# Altium project CV25_Camera_DATN.PrjPcb
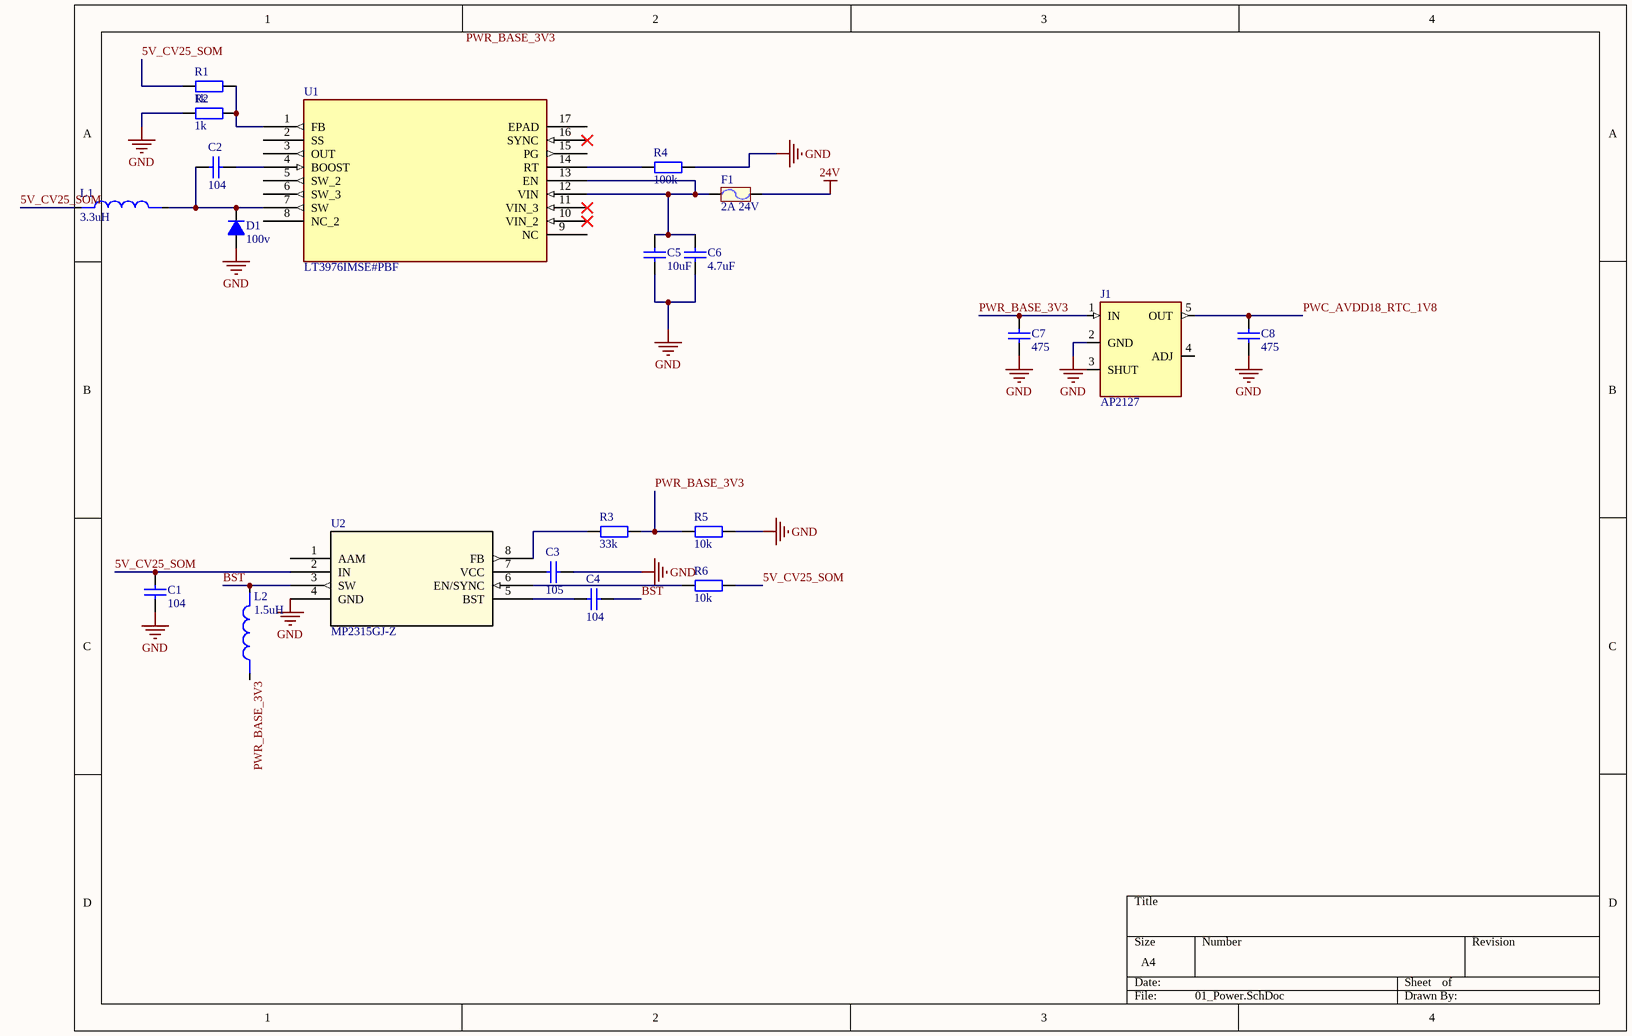
[diagram p0: 01_Power.SchDoc]
4 sheets, 69 parts. Net scope: global (net labels, ports and power ports of the same name join across sheets).
Board file: PCB1.PcbDoc
Sheets:
  01_Power.SchDoc
  02_CV25_SOM.SchDoc
  03_Ethernet.SchDoc
  05_LensControl.SchDoc

## Sheet 01_Power.SchDoc
size A4; SheetNumber: 1; SheetTotal: 5

### Parts
C1  104  [tu 0603]
C2  104  [tu 0603]
C3  105  [tu 0603]
C4  104  [tu 0603]
C5  10uF  [tu 0603]
C6  4.7uF  [tu 0603]
C7  475  [tu 0805]
C8  475  [tu 0805]
D1  100v  [DIODE 1A]
F1  2A 24V  [Cau chi tu phuc hoi 2A 24V SMD1812]
J1  AP2127  [AP2127K-3.3]
L1  3.3uH  [CUON CAM SMD 0530]
L2  1.5uH  [CUON CAM SMD 0530]
R1  1k  [tro smd 0603]
R2  1k  [tro smd 0603]
R3  33k  [Tro smd 0603]
R4  100k  [tro smd 0805]
R5  10k  [tro smd 0603]
R6  10k  [tro smd 0603]
U1  LT3976IMSE#PBF  [MSOP-16_MSE]
U2  MP2315GJ-Z  [TSOT23-8_MPS]

### Nets
24V: F1.2
GND: C1.2 C3.1 C5.1 C6.1 C7.2 C8.2 D1.1(A) J1.2(GND) R2.1 R4.2 R5.2 U2.4(GND)
5V_CV25_SOM: C1.1 L1.1 R1.1 R6.2 U2.2(IN)
BST: C4.1 L2.2 U2.3(SW)
PWC_AVDD18_RTC_1V8: C8.1 J1.5(OUT)
PWR_BASE_3V3: C7.1 J1.1(IN) L2.1 R3.2 R5.1
NetC2_1: C2.1 U1.4(BOOST)
NetC2_2: C2.2 D1.2(K) L1.2 U1.7(SW)
NetC3_2: C3.2 U2.7(VCC)
NetC4_2: C4.2 U2.5(BST)
NetC5_2: C5.2 C6.2 F1.1 U1.12(VIN) U1.13(EN)
NetR1_2: R1.2 R2.2 U1.1(FB)
NetR3_1: R3.1 U2.8(FB)
NetR4_1: R4.1 U1.14(RT)
NetR6_1: R6.1 U2.6(EN/SYNC)

Not connected (* = marked no-connect by the designer): J1 3(SHUT) 4(ADJ); U1 2(SS) 3(OUT) 5(SW_2) 6(SW_3) 8(NC_2) 9(NC) 10(VIN_2)* 11(VIN_3)* 15(PG) 16(SYNC)* 17(EPAD); U2 1(AAM)

### Notes on the sheet
- Labels drawn without touching a wire or pin: PWR_BASE_3V3

### Library data of the parts
C1 C2 C4 = Tu 0603 104 50V 10%: Dán; Don_Vi: Con; So_Chan: 2; Ten_Linh_Kien: Tụ 0603 104-100nF 10% 50V; Ma_Hang: MH004568; Chung_Loai: Dán; Kieu_Chan: *
C3 = Tu 0603 105 16V 20%: Dán; Don_Vi: Con; So_Chan: 2; Ten_Linh_Kien: Tụ 0603 105-1uF 20% 16V; Ma_Hang: MH004574; Chung_Loai: Dán; Kieu_Chan: *
C5 C6 = Tu 0603 470pF 50V 10%: Dán; Don_Vi: Con; So_Chan: 2; Ten_Linh_Kien: Tụ 0603 470P 50V 10%; Ma_Hang: MH004571; Chung_Loai: Dán; Kieu_Chan: *
C7 C8 = Tu 0805 475 25V 20%: Dán; Don_Vi: Con; So_Chan: 2; Ten_Linh_Kien: Tụ 0805 475-4.7uF 20% 25V; Ma_Hang: MH004276; Chung_Loai: Dán; Kieu_Chan: *
D1 = Diode 1N4007: Cắm; Ten_Linh_Kien: Diode 1N4007 1A (DIP); Don_Vi: Con; Ma_Hang: MH001063; Ghi Chu: *; Kieu_Chan: *; Chung_Loai: Cắm
F1 = Cau chi tu phuc hoi 2A 24V SMD1812: 2A 24V SMD1812; Ma_Hang: MH010033; Ten: Cầu Chì Tự Phục Hồi 2A 24V SMD1812
J1 = AP2127: LDO Regulator Pos 1.8V 0.4A 5-Pin SOT-23 T/R / IC REG LDO 1.8V 0.3A SOT23-5; MF: Diodes Incorporated; SnapEDA_Link: https://www.snapeda.com/parts/AP2127/EDTM+Incorporated/view-part/?ref=snap; Package: None; Value: *; MP: AP2127; Check_prices: https://www.snapeda.com/parts/AP2127/EDTM+Incorporated/view-part/?ref=eda
L1 L2 = Cuon Cam SMD 0530: SMD 0530; MP: FDV0530-H-1R5M=P3; Package: None; Price: None; Value: *; Availability: Unavailable
R1 R2 = Tro 0603 1% 1k: Dán; So_Chan: 2; Don_Vi: Con; Ten_Linh_Kien: Trở 0603 1% 1k; Ma_Hang: MH006334; Chung_Loai: Dán; Kieu_Chan: *
R3 = Tro 0603 1% 33k: Dán; Don_Vi: Con; So_Chan: 2; Ten_Linh_Kien: Trở 0603 1% 33k; Ma_Hang: MH006335; Chung_Loai: Dán; Kieu_Chan: *
R4 = Tro 0805 5% 100k: Dán; Don_Vi: Con; So_Chan: 2; Ten_Linh_Kien: Trở 0805 5% 100k; Ma_Hang: MH005250; Chung_Loai: Dán; Kieu_Chan: *
R5 R6 = Tro 0603 1% 10k: Dán; Don_Vi: Con; So_Chan: 2; Ten_Linh_Kien: Trở 0603 1% 10k; Ma_Hang: MH006333; Chung_Loai: Dán; Kieu_Chan: *
U1 = LT3976IMSE#PBF: 40V, 5A, 2MHz Step-Down Switching Regulator with 3.3Î¼A Quiescent Current; MF: Analog Devices; Value: *; Price: None; Package: MSOP -16 Analog Devices; MP: LT3976IMSE#PBF; Purchase-URL: https://pricing.snapeda.com/search/part/LT3976IMSE#PBF/?ref=eda; SnapEDA_Link: https://www.snapeda.com/parts/LT3976IMSE%23PBF/Analog+Devices/view-part/?ref=snap; Check_prices: https://www.snapeda.com/parts/LT3976IMSE%23PBF/Analog+Devices/view-part/?ref=eda; Availability: In Stock
U2 = MP2315GJ-Z: High Efficiency 3A 24V 500kHz with AAM (light load mode) Synchronous Step Down Converter in TSOT23-8; Manufacturer_Name: Monolithic Power Systems; Copyright: Copyright (C) 2026 Ultra Librarian. All rights reserved.; Manufacturer_Part_Number: MP2315GJ-Z; RefDes: RefDes; Type: Type

## Sheet 02_CV25_SOM.SchDoc
size A4; SheetNumber: 2; SheetTotal: 5
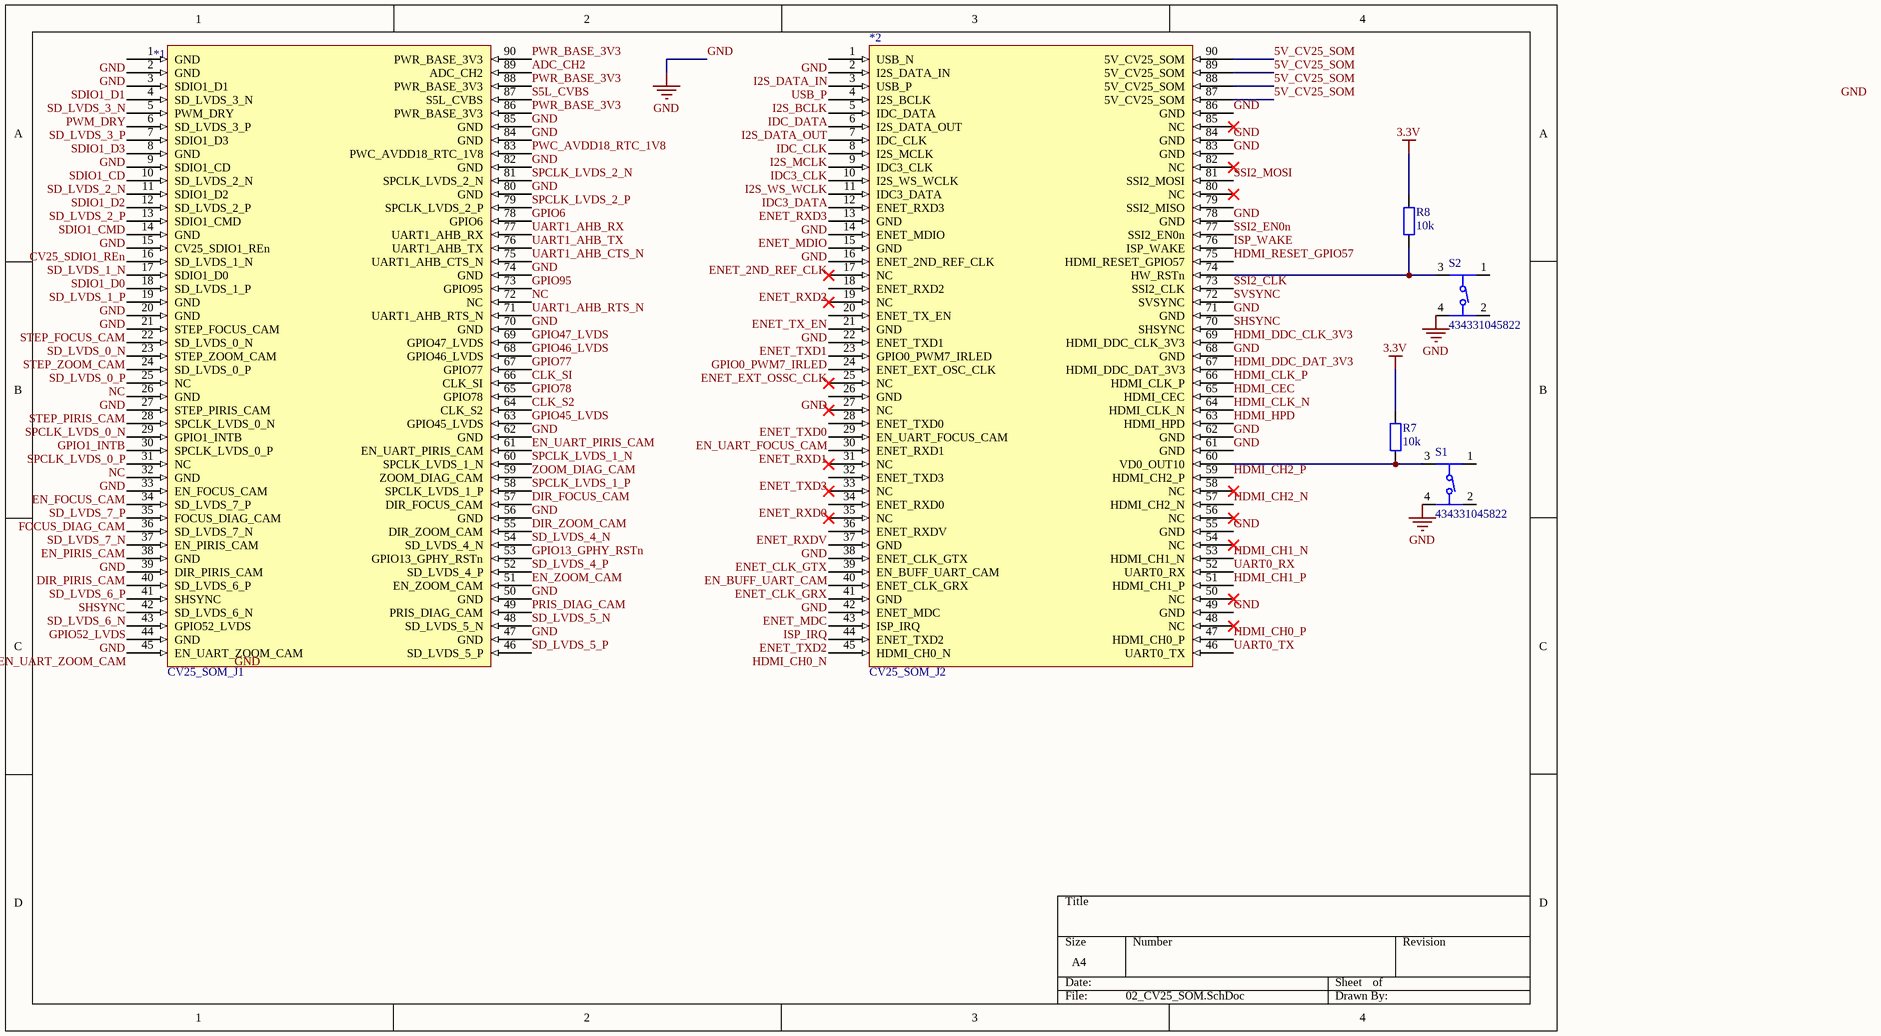
[diagram p1: 02_CV25_SOM.SchDoc]

### Parts
*1  CV25_SOM_J1  [HIROSE_DF40C-90DS-0.4V(51)]
*2  CV25_SOM_J2  [HIROSE_DF40C-90DS-0.4V(51)]
R7  10k  [tro smd 0603]
R8  10k  [tro smd 0603]
S1  434331045822  [4343X10458XX]
S2  434331045822  [4343X10458XX]

### Nets
3.3V: R7.2 R8.2
GND: *1.1(GND) *1.2(GND) *1.8(GND) *1.14(GND) *1.19(GND) *1.20(GND) *1.26(GND) *1.32(GND) *1.38(GND) *1.44(GND) *1.47(GND) *1.50(GND) *1.56(GND) *1.62(GND) *1.70(GND) *1.74(GND) *1.80(GND) *1.82(GND) *1.84(GND) *1.85(GND) *2.1(USB_N) *2.13(GND) *2.15(GND) *2.21(GND) *2.26(GND) *2.37(GND) *2.41(GND) *2.49(GND) *2.55(GND) *2.61(GND) *2.62(GND) *2.68(GND) *2.71(GND) *2.78(GND) *2.83(GND) *2.84(GND) *2.86(GND) S1.4 S2.4
5V_CV25_SOM: *2.87(5V_CV25_SOM) *2.88(5V_CV25_SOM) *2.89(5V_CV25_SOM) *2.90(5V_CV25_SOM)
ADC_CH2: *1.89(ADC_CH2)
CLK_S2: *1.64(CLK_S2)
CLK_SI: *1.66(CLK_SI)
CV25_SDIO1_REn: *1.15(CV25_SDIO1_REn)
DIR_FOCUS_CAM: *1.57(DIR_FOCUS_CAM)
DIR_PIRIS_CAM: *1.39(DIR_PIRIS_CAM)
DIR_ZOOM_CAM: *1.55(DIR_ZOOM_CAM)
EN_BUFF_UART_CAM: *2.39(EN_BUFF_UART_CAM)
EN_FOCUS_CAM: *1.33(EN_FOCUS_CAM)
EN_PIRIS_CAM: *1.37(EN_PIRIS_CAM)
EN_UART_FOCUS_CAM: *2.29(EN_UART_FOCUS_CAM)
EN_UART_PIRIS_CAM: *1.61(EN_UART_PIRIS_CAM)
EN_UART_ZOOM_CAM: *1.45(EN_UART_ZOOM_CAM)
EN_ZOOM_CAM: *1.51(EN_ZOOM_CAM)
ENET_2ND_REF_CLK: *2.16(ENET_2ND_REF_CLK)
ENET_CLK_GRX: *2.40(ENET_CLK_GRX)
ENET_CLK_GTX: *2.38(ENET_CLK_GTX)
ENET_EXT_OSSC_CLK: *2.24(ENET_EXT_OSC_CLK)
ENET_MDC: *2.42(ENET_MDC)
ENET_MDIO: *2.14(ENET_MDIO)
ENET_RXD0: *2.34(ENET_RXD0)
ENET_RXD1: *2.30(ENET_RXD1)
ENET_RXD2: *2.18(ENET_RXD2)
ENET_RXD3: *2.12(ENET_RXD3)
ENET_RXDV: *2.36(ENET_RXDV)
ENET_TX_EN: *2.20(ENET_TX_EN)
ENET_TXD0: *2.28(ENET_TXD0)
ENET_TXD1: *2.22(ENET_TXD1)
ENET_TXD2: *2.44(ENET_TXD2)
ENET_TXD3: *2.32(ENET_TXD3)
FOCUS_DIAG_CAM: *1.35(FOCUS_DIAG_CAM)
GPIO0_PWM7_IRLED: *2.23(GPIO0_PWM7_IRLED)
GPIO1_INTB: *1.29(GPIO1_INTB)
GPIO6: *1.78(GPIO6)
GPIO13_GPHY_RSTn: *1.53(GPIO13_GPHY_RSTn)
GPIO45_LVDS: *1.63(GPIO45_LVDS)
GPIO46_LVDS: *1.68(GPIO46_LVDS)
GPIO47_LVDS: *1.69(GPIO47_LVDS)
GPIO52_LVDS: *1.43(GPIO52_LVDS)
GPIO77: *1.67(GPIO77)
GPIO78: *1.65(GPIO78)
GPIO95: *1.73(GPIO95)
HDMI_CEC: *2.65(HDMI_CEC)
HDMI_CH0_N: *2.45(HDMI_CH0_N)
HDMI_CH0_P: *2.47(HDMI_CH0_P)
HDMI_CH1_N: *2.53(HDMI_CH1_N)
HDMI_CH1_P: *2.51(HDMI_CH1_P)
HDMI_CH2_N: *2.57(HDMI_CH2_N)
HDMI_CH2_P: *2.59(HDMI_CH2_P)
HDMI_CLK_N: *2.64(HDMI_CLK_N)
HDMI_CLK_P: *2.66(HDMI_CLK_P)
HDMI_DDC_CLK_3V3: *2.69(HDMI_DDC_CLK_3V3)
HDMI_DDC_DAT_3V3: *2.67(HDMI_DDC_DAT_3V3)
HDMI_HPD: *2.63(HDMI_HPD)
HDMI_RESET_GPIO57: *2.75(HDMI_RESET_GPIO57)
I2S_BCLK: *2.4(I2S_BCLK)
I2S_DATA_IN: *2.2(I2S_DATA_IN)
I2S_DATA_OUT: *2.6(I2S_DATA_OUT)
I2S_MCLK: *2.8(I2S_MCLK)
I2S_WS_WCLK: *2.10(I2S_WS_WCLK)
IDC3_CLK: *2.9(IDC3_CLK)
IDC3_DATA: *2.11(IDC3_DATA)
IDC_CLK: *2.7(IDC_CLK)
IDC_DATA: *2.5(IDC_DATA)
ISP_IRQ: *2.43(ISP_IRQ)
ISP_WAKE: *2.76(ISP_WAKE)
NC: *1.25(NC) *1.31(NC) *1.72(NC)
PRIS_DIAG_CAM: *1.49(PRIS_DIAG_CAM)
PWC_AVDD18_RTC_1V8: *1.83(PWC_AVDD18_RTC_1V8)
PWM_DRY: *1.5(PWM_DRY)
PWR_BASE_3V3: *1.86(PWR_BASE_3V3) *1.88(PWR_BASE_3V3) *1.90(PWR_BASE_3V3)
S5L_CVBS: *1.87(S5L_CVBS)
SD_LVDS_0_N: *1.22(SD_LVDS_0_N)
SD_LVDS_0_P: *1.24(SD_LVDS_0_P)
SD_LVDS_1_N: *1.16(SD_LVDS_1_N)
SD_LVDS_1_P: *1.18(SD_LVDS_1_P)
SD_LVDS_2_N: *1.10(SD_LVDS_2_N)
SD_LVDS_2_P: *1.12(SD_LVDS_2_P)
SD_LVDS_3_N: *1.4(SD_LVDS_3_N)
SD_LVDS_3_P: *1.6(SD_LVDS_3_P)
SD_LVDS_4_N: *1.54(SD_LVDS_4_N)
SD_LVDS_4_P: *1.52(SD_LVDS_4_P)
SD_LVDS_5_N: *1.48(SD_LVDS_5_N)
SD_LVDS_5_P: *1.46(SD_LVDS_5_P)
SD_LVDS_6_N: *1.42(SD_LVDS_6_N)
SD_LVDS_6_P: *1.40(SD_LVDS_6_P)
SD_LVDS_7_N: *1.36(SD_LVDS_7_N)
SD_LVDS_7_P: *1.34(SD_LVDS_7_P)
SDIO1_CD: *1.9(SDIO1_CD)
SDIO1_CMD: *1.13(SDIO1_CMD)
SDIO1_D0: *1.17(SDIO1_D0)
SDIO1_D1: *1.3(SDIO1_D1)
SDIO1_D2: *1.11(SDIO1_D2)
SDIO1_D3: *1.7(SDIO1_D3)
SHSYNC: *1.41(SHSYNC) *2.70(SHSYNC)
SPCLK_LVDS_0_N: *1.28(SPCLK_LVDS_0_N)
SPCLK_LVDS_0_P: *1.30(SPCLK_LVDS_0_P)
SPCLK_LVDS_1_N: *1.60(SPCLK_LVDS_1_N)
SPCLK_LVDS_1_P: *1.58(SPCLK_LVDS_1_P)
SPCLK_LVDS_2_N: *1.81(SPCLK_LVDS_2_N)
SPCLK_LVDS_2_P: *1.79(SPCLK_LVDS_2_P)
SSI2_CLK: *2.73(SSI2_CLK)
SSI2_EN0n: *2.77(SSI2_EN0n)
SSI2_MOSI: *2.81(SSI2_MOSI)
STEP_FOCUS_CAM: *1.21(STEP_FOCUS_CAM)
STEP_PIRIS_CAM: *1.27(STEP_PIRIS_CAM)
STEP_ZOOM_CAM: *1.23(STEP_ZOOM_CAM)
SVSYNC: *2.72(SVSYNC)
UART0_RX: *2.52(UART0_RX)
UART0_TX: *2.46(UART0_TX)
UART1_AHB_CTS_N: *1.75(UART1_AHB_CTS_N)
UART1_AHB_RTS_N: *1.71(UART1_AHB_RTS_N)
UART1_AHB_RX: *1.77(UART1_AHB_RX)
UART1_AHB_TX: *1.76(UART1_AHB_TX)
USB_P: *2.3(USB_P)
ZOOM_DIAG_CAM: *1.59(ZOOM_DIAG_CAM)
Net*2_60: *2.60(VD0_OUT10) R7.1 S1.3
Net*2_74: *2.74(HW_RSTn) R8.1 S2.3

Not connected (* = marked no-connect by the designer): *2 17(NC)* 19(NC)* 25(NC)* 27(NC)* 31(NC)* 33(NC)* 35(NC)* 48(NC)* 50(NC)* 54(NC)* 56(NC)* 58(NC)* 79(SSI2_MISO) 80(NC)* 82(NC)* 85(NC)*; S1 1(3) 2(4); S2 1(3) 2(4)

### Notes on the sheet
- Labels drawn without touching a wire or pin: GND

### Library data of the parts
R7 R8 = Tro 0603 1% 10k: as R5 on sheet 01_Power; Chung_Loai: Dán; Kieu_Chan: *
S1 S2 = 434331045822: MF: {'manufacturer': u'W\xfcrth Elektronik'}; Package: None; Price: None; Value: *; MP: 434331045822; Availability: Unavailable

## Sheet 03_Ethernet.SchDoc
size A4; SheetNumber: 3; SheetTotal: 5
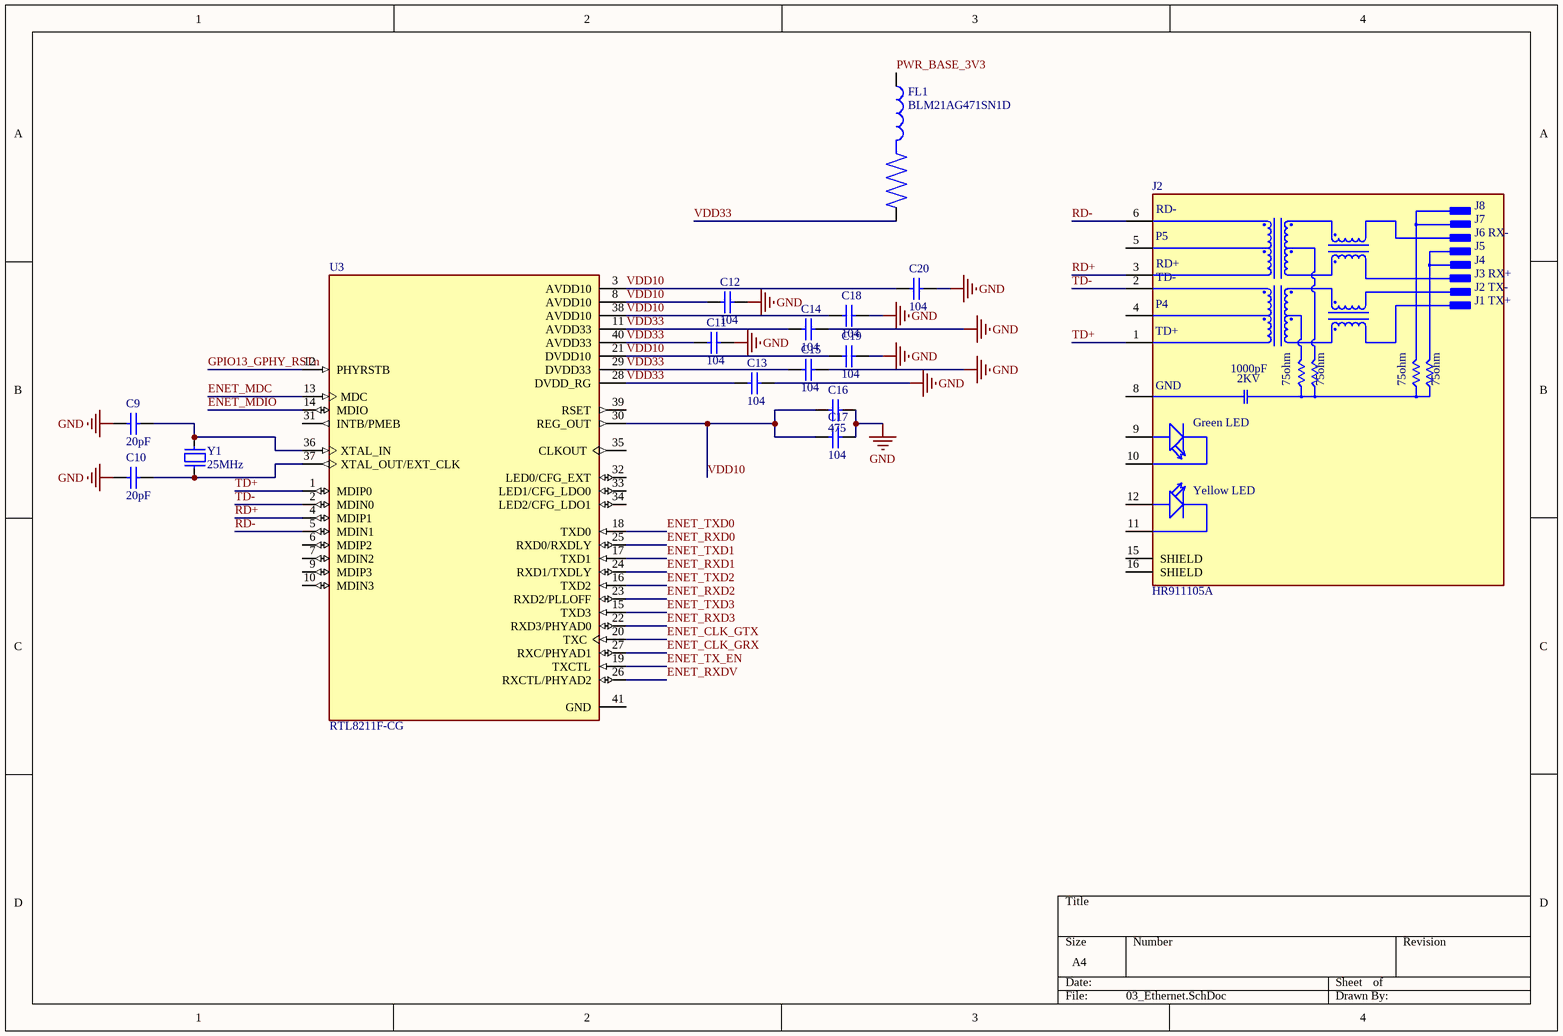
[diagram p2: 03_Ethernet.SchDoc]

### Parts
C9  20pF  [tu 0805]
C10  20pF  [tu 0805]
C11  104  [tu 1206]
C12  104  [tu 1206]
C13  104  [tu 1206]
C14  104  [tu 1206]
C15  104  [tu 1206]
C16  475  [tu 0805]
C17  104  [tu 1206]
C18  104  [tu 1206]
C19  104  [tu 1206]
C20  104  [tu 1206]
FL1  BLM21AG471SN1D  [BEADC2012X105N]
J2  HR911105A  [HANRUN_HR911105A]
U3  RTL8211F-CG  [QFN40P500X500X90-41N]
Y1  25MHz  [Thach Anh 2 Chan 32,768 KHz]

### Nets
GND: C9.1 C10.1 C11.1 C12.1 C13.1 C14.1 C15.1 C16.1 C17.1 C18.1 C19.1 C20.1
ENET_CLK_GRX: U3.27(RXC/PHYAD1)
ENET_CLK_GTX: U3.20(TXC)
ENET_MDC: U3.13(MDC)
ENET_MDIO: U3.14(MDIO)
ENET_RXD0: U3.25(RXD0/RXDLY)
ENET_RXD1: U3.24(RXD1/TXDLY)
ENET_RXD2: U3.23(RXD2/PLLOFF)
ENET_RXD3: U3.22(RXD3/PHYAD0)
ENET_RXDV: U3.26(RXCTL/PHYAD2)
ENET_TX_EN: U3.19(TXCTL)
ENET_TXD0: U3.18(TXD0)
ENET_TXD1: U3.17(TXD1)
ENET_TXD2: U3.16(TXD2)
ENET_TXD3: U3.15(TXD3)
GPIO13_GPHY_RSTn: U3.12(PHYRSTB)
PWR_BASE_3V3: FL1.1
RD+: J2.3(RD+) U3.4(MDIP1)
RD-: J2.6(RD-) U3.5(MDIN1)
TD+: J2.1(TD+) U3.1(MDIP0)
TD-: J2.2(TD-) U3.2(MDIN0)
VDD10: C12.2 C16.2 C17.2 C18.2 C19.2 C20.2 U3.3(AVDD10) U3.8(AVDD10) U3.21(DVDD10) U3.30(REG_OUT) U3.38(AVDD10)
VDD33: C11.2 C13.2 C14.2 C15.2 FL1.2 U3.11(AVDD33) U3.28(DVDD_RG) U3.29(DVDD33) U3.40(AVDD33)
NetC9_2: C9.2 U3.36(XTAL_IN) Y1.2
NetC10_2: C10.2 U3.37(XTAL_OUT/EXT_CLK) Y1.1

Not connected (* = marked no-connect by the designer): J2 4(P4) 5(P5) 8(GND) 9(GA) 10(GC) 11(YC) 12(YA) 15(SHIELD) 16(SHIELD); U3 6(MDIP2) 7(MDIN2) 9(MDIP3) 10(MDIN3) 31(INTB/PMEB) 32(LED0/CFG_EXT) 33(LED1/CFG_LDO0) 34(LED2/CFG_LDO1) 35(CLKOUT) 39(RSET) 41(GND)

### Notes on the sheet
- (in symbol HR911105A) J8; J7; J6 RX-; J5; J4; J3 RX+; J2 TX-; J1 TX+; 1000pF; 2KV; 75ohm; Green LED; Yellow LED

### Library data of the parts
C9 C10 = Tu 0805 20pF 50V 10%: Dán; Don_Vi: Con; Ten_Linh_Kien: Tụ 0805 20P 10% 50V; So_Chan: 2; Ma_Hang: MH004558; Chung_Loai: Dán; Kieu_Chan: *
C11-C15 C17-C20 = Tu 1206 104 50V 20%: Dán; Don_Vi: Con; So_Chan: 2; Ten_Linh_Kien: Tụ 1206 104-0.1uF 20% 50V; Ma_Hang: MH004544; Chung_Loai: Dán; Kieu_Chan: *
C16 = Tu 0805 475 25V 20%: as C7 on sheet 01_Power; Chung_Loai: Dán; Kieu_Chan: *
FL1 = BLM21AG471SN1D: 470 Ohms @ 100MHz 1 Ferrite Bead 0805 _2012 Metric_ 700mA 190mOhm; MF: Murata Electronics; Value: *; Package: 2012 Murata; MP: BLM21AG471SN1D; Price: None; SnapEDA_Link: https://www.snapeda.com/parts/BLM21AG471SN1D/Murata/view-part/291265/?ref=snap; Availability: Unavailable
J2 = HR911105A: DIP RJ45 Connector;; MF: hanrun; SnapEDA_Link: https://www.snapeda.com/parts/HR911105A/HanRun/view-part/?ref=snap; Package: None; MP: HR911105A; Check_prices: https://www.snapeda.com/parts/HR911105A/HanRun/view-part/?ref=eda; Price: None; Value: *; Availability: Not in stock
U3 = RTL8211F-CG: GbE PHY with RGMIII interface & EEE feature (Switch Regulator), QFN40; MF: Realtek Semiconductor Corp; SnapEDA_Link: https://www.snapeda.com/parts/RTL8211F-CG/Realtek/view-part/?ref=snap; Package: None; Value: *; MP: RTL8211F-CG; Check_prices: https://www.snapeda.com/parts/RTL8211F-CG/Realtek/view-part/?ref=eda
Y1 = Thach Anh 2 chan 32,768 Khz: Crystal For all Crystal 2pin.; Value: 4Mhz

## Sheet 05_LensControl.SchDoc
size A4; SheetNumber: 5; SheetTotal: 5
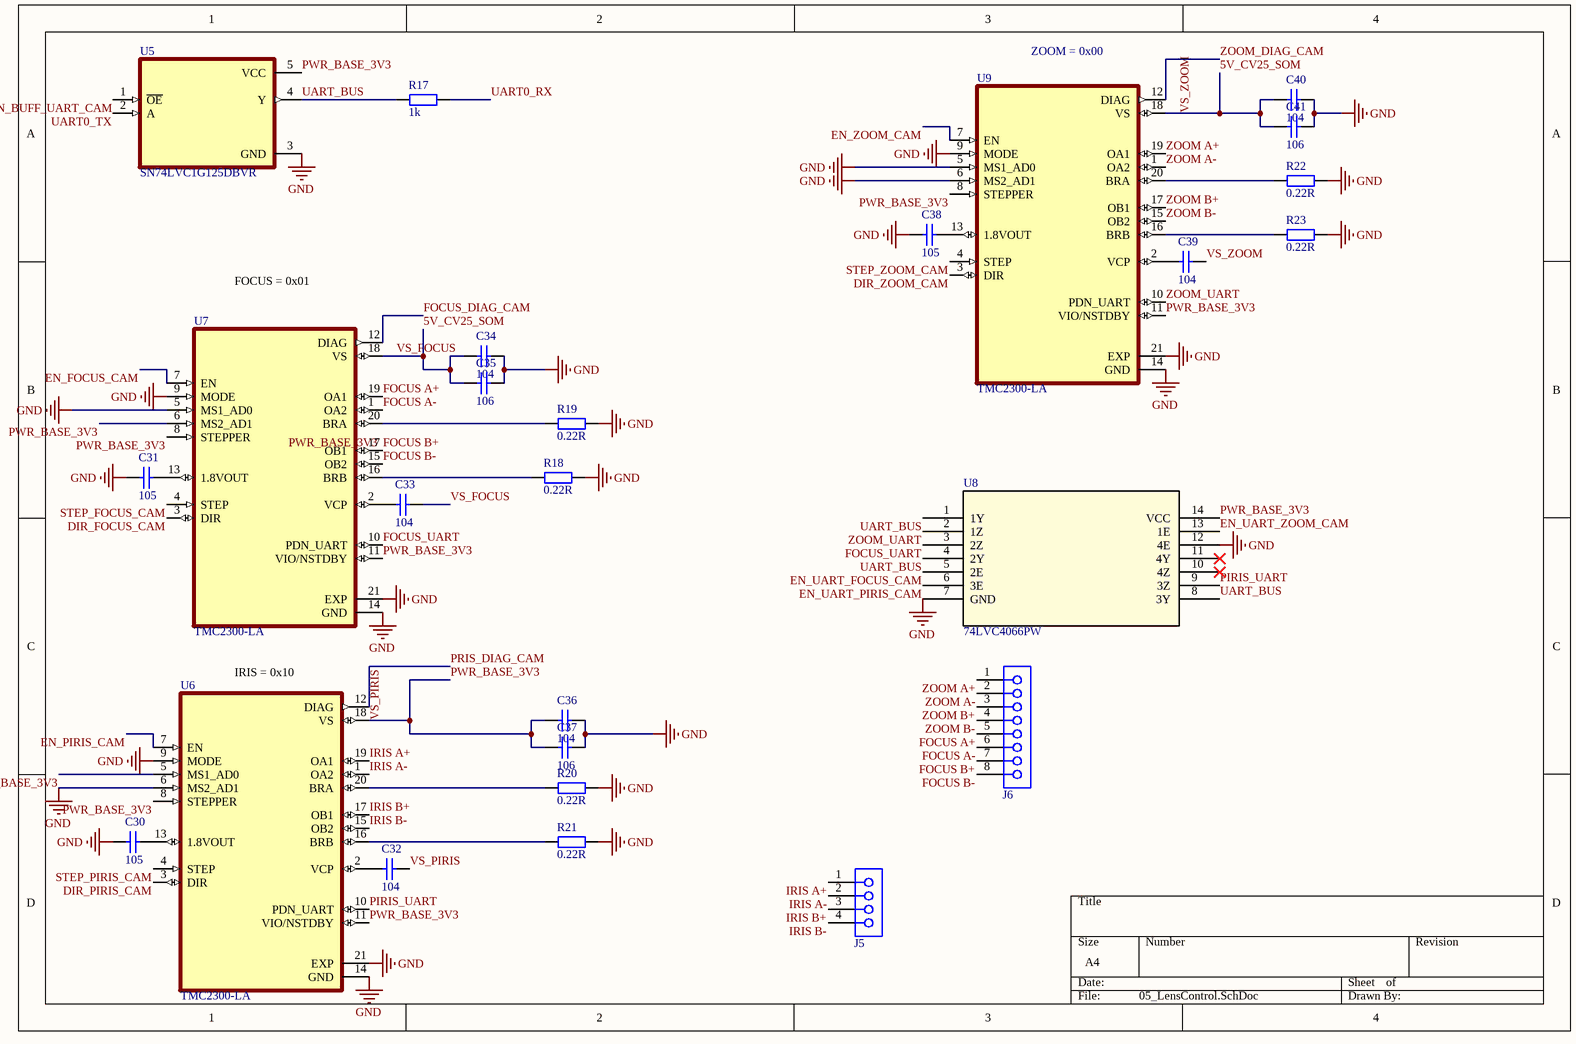
[diagram p3: 05_LensControl.SchDoc]

### Parts
C30  105  [tu 0805]
C31  105  [tu 0805]
C32  104  [tu 1206]
C33  104  [tu 1206]
C34  104  [tu 1206]
C35  106  [tu 0805]
C36  104  [tu 1206]
C37  106  [tu 0805]
C38  105  [tu 0805]
C39  104  [tu 1206]
C40  104  [tu 1206]
C41  106  [tu 0805]
J5  61000411921  [61000411921]  (value not drawn)
J6  61000811921  [61000811921]  (value not drawn)
R17  1k  [tro smd 1206]
R18  0.22R  [tro smd 0805]
R19  0.22R  [tro smd 0805]
R20  0.22R  [tro smd 0805]
R21  0.22R  [tro smd 0805]
R22  0.22R  [tro smd 0805]
R23  0.22R  [tro smd 0805]
U5  SN74LVC1G125DBVR  [SOT95P280X145-5N]
U6  TMC2300-LA  [QFN40P300X300X90-21N]
U7  TMC2300-LA  [QFN40P300X300X90-21N]
U8  74LVC4066PW  [SOT402-1_NXP]
U9  TMC2300-LA  [QFN40P300X300X90-21N]

### Nets
GND: C30.2 C31.2 C34.1 C35.1 C36.1 C37.1 C38.2 C40.1 C41.1 R18.2 R19.2 R20.2 R21.2 R22.2 R23.2 U5.3(GND) U6.6(MS2_AD1) U6.9(MODE) U6.14(GND) U6.21(EXP) U7.5(MS1_AD0) U7.9(MODE) U7.14(GND) U7.21(EXP) U8.7(GND) U8.12(4E) U9.5(MS1_AD0) U9.6(MS2_AD1) U9.9(MODE) U9.14(GND) U9.21(EXP)
5V_CV25_SOM: C33.2 C34.2 C35.2 C39.2 C40.2 C41.2 U7.18(VS) U9.18(VS)  [also labelled VS_FOCUS, VS_ZOOM]
DIR_FOCUS_CAM: U7.3(DIR)
DIR_PIRIS_CAM: U6.3(DIR)
DIR_ZOOM_CAM: U9.3(DIR)
EN_BUFF_UART_CAM: U5.1(~{OE})
EN_FOCUS_CAM: U7.7(EN)
EN_PIRIS_CAM: U6.7(EN)
EN_UART_FOCUS_CAM: U8.5(2E)
EN_UART_PIRIS_CAM: U8.6(3E)
EN_UART_ZOOM_CAM: U8.13(1E)
EN_ZOOM_CAM: U9.7(EN)
FOCUS A+: J6.5 U7.19(OA1)
FOCUS A-: J6.6 U7.1(OA2)
FOCUS B+: J6.7 U7.17(OB1)
FOCUS B-: J6.8 U7.15(OB2)
FOCUS_DIAG_CAM: U7.12(DIAG)
FOCUS_UART: U7.10(PDN_UART) U8.3(2Z)
IRIS A+: J5.1 U6.19(OA1)
IRIS A-: J5.2 U6.1(OA2)
IRIS B+: J5.3 U6.17(OB1)
IRIS B-: J5.4 U6.15(OB2)
PIRIS_UART: U6.10(PDN_UART) U8.9(3Z)
PRIS_DIAG_CAM: U6.12(DIAG)
PWR_BASE_3V3: C32.2 C36.2 C37.2 U5.5(VCC) U6.5(MS1_AD0) U6.8(STEPPER) U6.11(VIO/NSTDBY) U6.18(VS) U7.6(MS2_AD1) U7.8(STEPPER) U7.11(VIO/NSTDBY) U8.14(VCC) U9.8(STEPPER) U9.11(VIO/NSTDBY)  [also labelled VS_PIRIS]
STEP_FOCUS_CAM: U7.4(STEP)
STEP_PIRIS_CAM: U6.4(STEP)
STEP_ZOOM_CAM: U9.4(STEP)
UART0_RX: R17.2
UART0_TX: U5.2(A)
UART_BUS: R17.1 U5.4(Y) U8.1(1Y) U8.4(2Y) U8.8(3Y)
ZOOM A+: J6.1 U9.19(OA1)
ZOOM A-: J6.2 U9.1(OA2)
ZOOM B+: J6.3 U9.17(OB1)
ZOOM B-: J6.4 U9.15(OB2)
ZOOM_DIAG_CAM: U9.12(DIAG)
ZOOM_UART: U8.2(1Z) U9.10(PDN_UART)
NetC30_1: C30.1 U6.13(1.8VOUT)
NetC31_1: C31.1 U7.13(1.8VOUT)
NetC32_1: C32.1 U6.2(VCP)
NetC33_1: C33.1 U7.2(VCP)
NetC38_1: C38.1 U9.13(1.8VOUT)
NetC39_1: C39.1 U9.2(VCP)
NetR18_1: R18.1 U7.16(BRB)
NetR19_1: R19.1 U7.20(BRA)
NetR20_1: R20.1 U6.20(BRA)
NetR21_1: R21.1 U6.16(BRB)
NetR22_1: R22.1 U9.20(BRA)
NetR23_1: R23.1 U9.16(BRB)

Not connected (* = marked no-connect by the designer): U8 10(4Z)* 11(4Y)*

### Notes on the sheet
- (near U9) ZOOM = 0x00
- FOCUS = 0x01
- (near U6) IRIS = 0x10
- Labels drawn without touching a wire or pin: PWR_BASE_3V3

### Library data of the parts
C30 C31 C38 = Tu 0805 105 50V 10%: Dán; Don_Vi: Con; So_Chan: 2; Ten_Linh_Kien: Tụ 0805 105-1uF 10% 50V; Ma_Hang: MH004552; Chung_Loai: Dán; Kieu_Chan: *
C32-C34 C36 C39 C40 = Tu 1206 104 50V 20%: as C11 on sheet 03_Ethernet; Chung_Loai: Dán; Kieu_Chan: *
C35 C37 C41 = Tu 0805 106 16V 10%: Dán; Ten_Linh_Kien: Tụ 0805 106-10uF 10% 16V; So_Chan: 2; Don_Vi: Con; Ma_Hang: MH004553; Chung_Loai: Dán; Kieu_Chan: *
J5 = 61000411921: WR-PHD Socket Header, SMT, Vertical, pitch 2.54mm, 1 Row, 4P; Manufacturer: Wurth Elektronik; Contact Resistance: 20mOhm; Rated Current: 3A; Working Voltage: 250V; Withstanding Voltage: 500V; Manufacturer Part Number: 61000411921; Category: Board-to-Board Connectors; Match Code: WR-PHD; ComponentLink1Description: Website Link; ComponentLink1URL: https://www.we-online.com/redexpert/article/61000411921?ad; ComponentLink2Description: Datasheet Link; ComponentLink2URL: https://www.we-online.com/redexpert/spec/61000411921?ad; Mount: Surface Mount; Operating Temperature Max: 105°C; Operating Temperature Min: -40°C; Packaging: Tube; Gender: Socket Header; Number of Pins: 4; Number of Rows: 1; Orientation: Vertical; Pitch: 2.54mm
J6 = 61000811921: WR-PHD Socket Header, SMT, Vertical, pitch 2.54mm, 1 Row, 8P; Manufacturer: Wurth Elektronik; Contact Resistance: 20mOhm; Rated Current: 3A; Working Voltage: 250V; Withstanding Voltage: 500V; Manufacturer Part Number: 61000811921; Category: Board-to-Board Connectors; Match Code: WR-PHD; ComponentLink1Description: Website Link; ComponentLink1URL: https://www.we-online.com/redexpert/article/61000811921?ad; ComponentLink2Description: Datasheet Link; ComponentLink2URL: https://www.we-online.com/redexpert/spec/61000811921?ad; Mount: Surface Mount; Operating Temperature Max: 105°C; Operating Temperature Min: -40°C; Packaging: Tube; Gender: Socket Header; Number of Pins: 8; Number of Rows: 1; Orientation: Vertical; Pitch: 2.54mm
R17 = Tro 1206 1% 1k: Dán; Don_Vi: Con; So_Chan: 2; Ten_Linh_Kien: Trở 1206 1% 1k; Ma_Hang: MH005880; Chung_Loai: Dán; Kieu_Chan: *
R18-R23 = Tro 0805 1% 0.22R: Dán; Don_Vi: Con; So_Chan: 2; Ten_Linh_Kien: Trở 0805 1% 0.22R; Ma_Hang: MH005466; Chung_Loai: Dán; Kieu_Chan: *
U5 = SN74LVC1G125DBVR: Single 1.65-V to 5.5-V buffer with 3-state outputs; MF: Texas Instruments; SnapEDA_Link: https://www.snapeda.com/parts/SN74LVC1G125DBVR/Texas+Instruments/view-part/?ref=snap; Package: SOT-23-5 Texas Instruments; Value: *; MP: SN74LVC1G125DBVR; Check_prices: https://www.snapeda.com/parts/SN74LVC1G125DBVR/Texas+Instruments/view-part/?ref=eda
U6 U7 U9 = TMC2300-LA: Maxim Low Voltage Stepper Motor Driver IC, Step/Dir, UART, 2-11V Supply, 1.2A, QFN20; MF: Maxim Integrated; Package: None; Availability: In Stock; SnapEDA_Link: https://www.snapeda.com/parts/TMC2300-LA/Maxim+Integrated/view-part/?ref=snap; MP: TMC2300-LA; Price: None; Check_prices: https://www.snapeda.com/parts/TMC2300-LA/Maxim+Integrated/view-part/?ref=eda; Value: *
U8 = 74LVC4066PW: Description; Manufacturer_Name: NXP; Copyright: Copyright (C) 2026 Ultra Librarian. All rights reserved.; Manufacturer_Part_Number: 74LVC4066PW; RefDes: RefDes; Type: Type

## Nets that join several sheets
GND: 01_Power (12 pins), 02_CV25_SOM (39 pins), 03_Ethernet (12 pins), 05_LensControl (31 pins)
5V_CV25_SOM: 01_Power (5 pins), 02_CV25_SOM (*2.87 *2.88 *2.89 *2.90), 05_LensControl (8 pins)
DIR_FOCUS_CAM: 02_CV25_SOM (*1.57), 05_LensControl (U7.3)
DIR_PIRIS_CAM: 02_CV25_SOM (*1.39), 05_LensControl (U6.3)
DIR_ZOOM_CAM: 02_CV25_SOM (*1.55), 05_LensControl (U9.3)
EN_BUFF_UART_CAM: 02_CV25_SOM (*2.39), 05_LensControl (U5.1)
EN_FOCUS_CAM: 02_CV25_SOM (*1.33), 05_LensControl (U7.7)
EN_PIRIS_CAM: 02_CV25_SOM (*1.37), 05_LensControl (U6.7)
EN_UART_FOCUS_CAM: 02_CV25_SOM (*2.29), 05_LensControl (U8.5)
EN_UART_PIRIS_CAM: 02_CV25_SOM (*1.61), 05_LensControl (U8.6)
EN_UART_ZOOM_CAM: 02_CV25_SOM (*1.45), 05_LensControl (U8.13)
EN_ZOOM_CAM: 02_CV25_SOM (*1.51), 05_LensControl (U9.7)
ENET_CLK_GRX: 02_CV25_SOM (*2.40), 03_Ethernet (U3.27)
ENET_CLK_GTX: 02_CV25_SOM (*2.38), 03_Ethernet (U3.20)
ENET_MDC: 02_CV25_SOM (*2.42), 03_Ethernet (U3.13)
ENET_MDIO: 02_CV25_SOM (*2.14), 03_Ethernet (U3.14)
ENET_RXD0: 02_CV25_SOM (*2.34), 03_Ethernet (U3.25)
ENET_RXD1: 02_CV25_SOM (*2.30), 03_Ethernet (U3.24)
ENET_RXD2: 02_CV25_SOM (*2.18), 03_Ethernet (U3.23)
ENET_RXD3: 02_CV25_SOM (*2.12), 03_Ethernet (U3.22)
ENET_RXDV: 02_CV25_SOM (*2.36), 03_Ethernet (U3.26)
ENET_TX_EN: 02_CV25_SOM (*2.20), 03_Ethernet (U3.19)
ENET_TXD0: 02_CV25_SOM (*2.28), 03_Ethernet (U3.18)
ENET_TXD1: 02_CV25_SOM (*2.22), 03_Ethernet (U3.17)
ENET_TXD2: 02_CV25_SOM (*2.44), 03_Ethernet (U3.16)
ENET_TXD3: 02_CV25_SOM (*2.32), 03_Ethernet (U3.15)
FOCUS_DIAG_CAM: 02_CV25_SOM (*1.35), 05_LensControl (U7.12)
GPIO13_GPHY_RSTn: 02_CV25_SOM (*1.53), 03_Ethernet (U3.12)
PRIS_DIAG_CAM: 02_CV25_SOM (*1.49), 05_LensControl (U6.12)
PWC_AVDD18_RTC_1V8: 01_Power (C8.1 J1.5), 02_CV25_SOM (*1.83)
PWR_BASE_3V3: 01_Power (5 pins), 02_CV25_SOM (*1.86 *1.88 *1.90), 03_Ethernet (FL1.1), 05_LensControl (14 pins)
STEP_FOCUS_CAM: 02_CV25_SOM (*1.21), 05_LensControl (U7.4)
STEP_PIRIS_CAM: 02_CV25_SOM (*1.27), 05_LensControl (U6.4)
STEP_ZOOM_CAM: 02_CV25_SOM (*1.23), 05_LensControl (U9.4)
UART0_RX: 02_CV25_SOM (*2.52), 05_LensControl (R17.2)
UART0_TX: 02_CV25_SOM (*2.46), 05_LensControl (U5.2)
ZOOM_DIAG_CAM: 02_CV25_SOM (*1.59), 05_LensControl (U9.12)